# EAGLE design PCB (EAGLE 9.5.1)
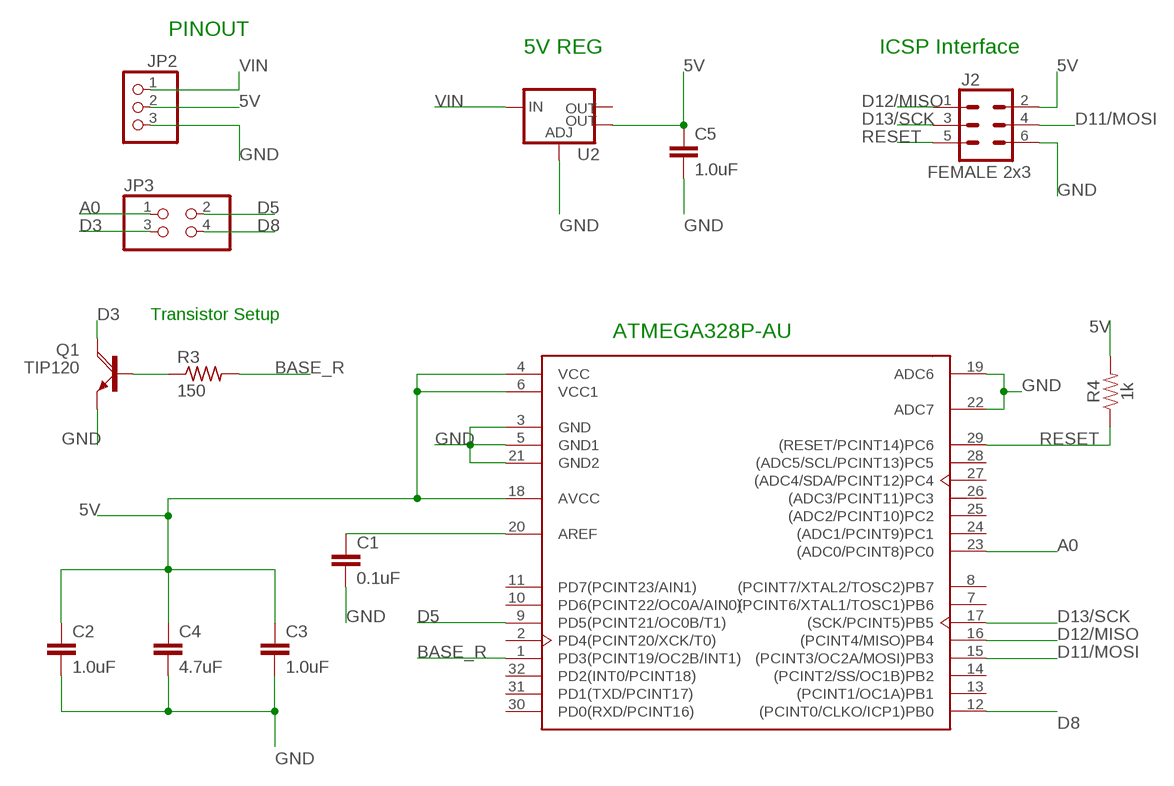
[diagram p0: schematic, sheet 1]

## Parts
C1  0.1uF  0.1UF-0603-25V-(+80/-20%)  [0603]
C2  1.0uF  1.0UF-0603-16V-10%  [0603]
C3  1.0uF  1.0UF-0603-16V-10%  [0603]
C4  4.7uF  4.7UF-1206-16V-(+80/-20%)  [1206]
C5  1.0uF  1.0UF-0603-16V-10%  [0603]
J2  FEMALE 2x3  CONN_03X2FEMALE  [2X3]
JP2  PINHEAD_PINHD-1X3  [PINHEAD_1X03]
JP3  PINHD-2X2  [2X02]
Q1  TIP120  [TO220AH]
R3  150  R-US_R0805  [R0805]
R4  1k  1KOHM-0603-1/10W-1%  [0603]
U1  ATMEGA328P-AU  [TQFP-32]
U2  V_REG_LM1117SOT223  [SOT223]

## Nets
5V: C2.1 C3.1 C4.1 C5.1 J2.2 JP2.2 R4.2 U1.4(VCC) U1.6(VCC1) U1.18(AVCC) U2.4(OUT)
A0: JP3.1 U1.23((ADC0/PCINT8)PC0)
BASE_R: R3.2 U1.1(PD3(PCINT19/OC2B/INT1))
D3: JP3.3 Q1.C
D5: JP3.2 U1.9(PD5(PCINT21/OC0B/T1))
D8: JP3.4 U1.12((PCINT0/CLKO/ICP1)PB0)
D11/MOSI: J2.4 U1.15((PCINT3/OC2A/MOSI)PB3)
D12/MISO: J2.1 U1.16((PCINT4/MISO)PB4)
D13/SCK: J2.3 U1.17((SCK/PCINT5)PB5)
GND: C1.2 C2.2 C3.2 C4.2 C5.2 J2.6 JP2.3 Q1.E U1.3(GND) U1.5(GND1) U1.19(ADC6) U1.21(GND2) U1.22(ADC7) U2.1(ADJ)
N$2: Q1.B R3.1
N$4: C1.1 U1.20(AREF)
RESET: J2.5 R4.1 U1.29((RESET/PCINT14)PC6)
VIN: JP2.1 U2.3(IN)
Unconnected: U1.2(PD4(PCINT20/XCK/T0)) U1.7((PCINT6/XTAL1/TOSC1)PB6) U1.8((PCINT7/XTAL2/TOSC2)PB7) U1.10(PD6(PCINT22/OC0A/AIN0)) U1.11(PD7(PCINT23/AIN1)) U1.13((PCINT1/OC1A)PB1) U1.14((PCINT2/SS/OC1B)PB2) U1.24((ADC1/PCINT9)PC1) U1.25((ADC2/PCINT10)PC2) U1.26((ADC3/PCINT11)PC3) U1.27((ADC4/SDA/PCINT12)PC4) U1.28((ADC5/SCL/PCINT13)PC5) U1.30(PD0(RXD/PCINT16)) U1.31(PD1(TXD/PCINT17)) U1.32(PD2(INT0/PCINT18)) U2.2(OUT)

## Notes on the sheet
- PINOUT
- 5V REG | ICSP Interface
- Transistor Setup
- ATMEGA328P-AU

## Library data of the parts
C1 = SparkFun-Capacitors:0.1UF: 0.1µF ceramic capacitors A capacitor is a passive two-terminal electrical component used to store electrical energy temporarily in an electric field.; PROD_ID: CAP-00810
C2 C3 C5 = SparkFun-Capacitors:1.0UF: 1µF ceramic capacitors A capacitor is a passive two-terminal electrical component used to store electrical energy temporarily in an electric field.; PROD_ID: CAP-00868
C4 = SparkFun-Capacitors:4.7UF: 4.7µF ceramic capacitors A capacitor is a passive two-terminal electrical component used to store electrical energy temporarily in an electric field.; PROD_ID: CAP-10300
J2 = SparkFun-Connectors:CONN_03X2: Multi connection point. Often used as Generic Header-pin footprint for 0.1 inch spaced/style header connections You can populate with any combo of single row headers, but if you'd like an exact match, check these: Header - 2x3 (Male, 0.1") <https://www.sparkfun.com/products/12807> (PRT-12807) Header - 2x3 (Female, 0.1") <https://www.sparkfun.com/products/13010> (PRT-13010) 2x3 Pin Shrouded Header <https://www.sparkfun.com/products/10877> (PRT-10877) On any of the 0.1 inch spaced packages, you can populate with these: Break Away Headers - Straight <https://www.sparkfun.com/products/116> (PRT-00116) Break Away Male Headers - Right Angle <https://www.sparkfun.com/products/553> (PRT-00553) Female Headers <https://www.sparkfun.com/products/115> (PRT-00115) Break Away Headers - Machine Pin <https://www.sparkfun.com/products/117> (PRT-00117) Break Away Female Headers - Swiss Machine Pin <https://www.sparkfun.com/products/743> (PRT-00743) Special note: the shrouded connector mates well with our 3x2 ribbon cables: Ribbon Crimp Connector - 6-pin (2x3, Female) <https://www.sparkfun.com/products/10651> (PRT-10651) Ribbon Cable - 6 wire (15ft) <https://www.sparkfun.com/products/10646> (PRT-10646); PROD_ID: CONN-11566
JP2 = IR_Sensor:PINHEAD_PINHD-1X3: PIN HEADER
JP3 = pinhead:PINHD-2X2: PIN HEADER
Q1 = transistor-power:TIP120: NPN DARLINGTON TRANSISTOR
R3 = rcl:R-US_: RESISTOR, American symbol; SPICEPREFIX: R
R4 = SparkFun-Resistors:1KOHM: 1kΩ resistor A resistor is a passive two-terminal electrical component that implements electrical resistance as a circuit element. Resistors act to reduce current flow, and, at the same time, act to lower voltage levels within circuits. - Wikipedia; PROD_ID: RES-07856
U1 = Microcontroller:ATMEGA328P-AU: IC MCU 8BIT 32KB FLASH 32TQFP Manufacturer's datasheet <http://ww1.microchip.com/downloads/en/DeviceDoc/ATmega48A-PA-88A-PA-168A-PA-328-P-DS-DS40002061A.pdf>; CREATED_BY: PCBLayout.com; DIGIKEY_PART_NUMBER: ATMEGA328P-AU-ND; MANUFACTURER: Microchip Technology; MPN: ATMEGA328P-AU; PACKAGE: TQFP-32
U2 = SparkFun-IC-Power:V_REG_LM1117: Voltage Regulator LM1117 Standard adjustable voltage regulator but in SMD form. Spark Fun Electronics SKU : COM-00595; PROD_ID: VREG-08170

## Board
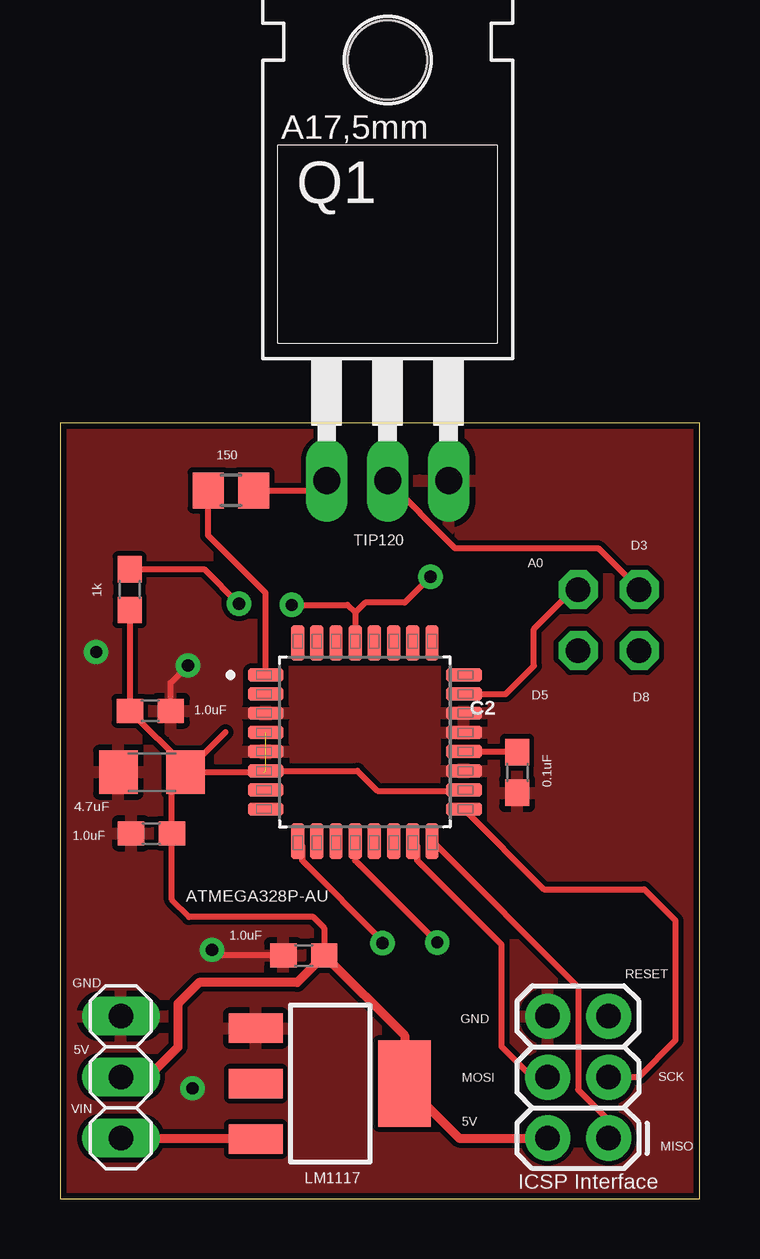
[diagram p1: board, top side]
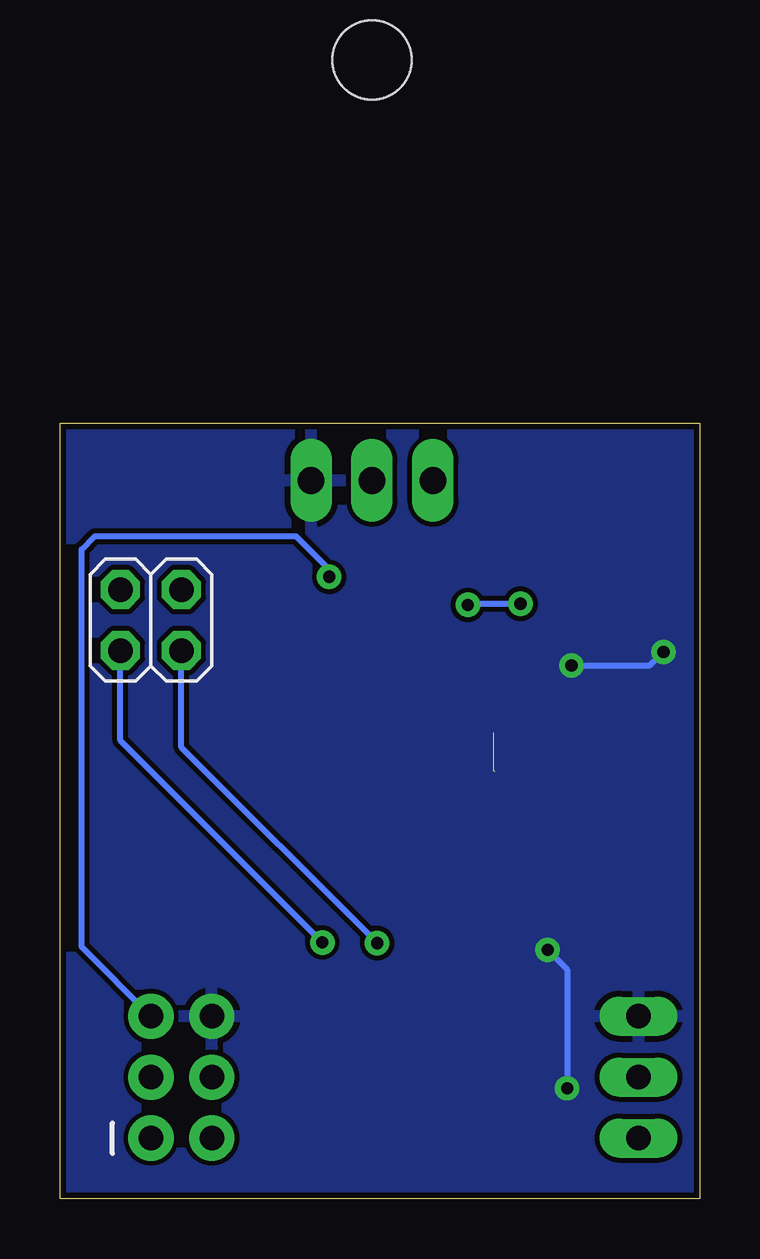
[diagram p2: board, bottom side, seen from below]

Size 26.65 x 32.35 mm. Coordinates in mm from the lower left corner, seen from the top.
Outline: 0,0 26.65,0 26.65,32.35 0,32.35 0,0
Copper layers (1*16): Top 0.035mm / dielectric 1.5mm / Bottom 0.035mm
Design rules "SparkFunDRC": minimum track width 8mil, minimum drill 20mil, track to track 8mil, track to pad 8mil, pad to pad 8mil, via to via 8mil, smd to smd 8mil, copper to edge 10mil, drill to drill 8mil, minimum pad ring 12mil, minimum via ring 10mil, stop-mask expansion 4mil, vias tented up to drill 25mil, thermal gap 10mil

### Footprints (pad centres in the part's own frame; a part is rotated, then mirrored left to right if it is on the bottom)
0603 = smd 1.1 x 1: 1 -0.85,0; 2 0.85,0
1206 = smd 1.6 x 1.8: 1 -1.4,0; 2 1.4,0
2X3 = drill 1.016 pad 1.88: 1 0,0; 2 0,2.54; 3 2.54,0; 4 2.54,2.54; 5 5.08,0; 6 5.08,2.54
PINHEAD_1X03 = drill 1.016 long: 1 -2.54,0; 2 0,0; 3 2.54,0
2X02 = drill 1.016 octagon: 1 -1.27,-1.27; 2 -1.27,1.27; 3 1.27,-1.27; 4 1.27,1.27
TO220AH = drill 1.118 long: B -2.54,-6.35; C 0,-6.35; E 2.54,-6.35 | hole 3.302: 0,11.176
R0805 = smd 1.3 x 1.5: 1 -0.95,0; 2 0.95,0
TQFP-32 = smd 1.5 x 0.57: 1 -4.13,2.8; 2 -4.13,2; 3 -4.13,1.2; 4 -4.13,0.4; 5 -4.13,-0.4; 6 -4.13,-1.2; 7 -4.13,-2; 8 -4.13,-2.8; 17 4.13,-2.8; 18 4.13,-2; 19 4.13,-1.2; 20 4.13,-0.4; 21 4.13,0.4; 22 4.13,1.2; 23 4.13,2; 24 4.13,2.8 | smd 0.57 x 1.5: 9 -2.8,-4.13; 10 -2,-4.13; 11 -1.2,-4.13; 12 -0.4,-4.13; 13 0.4,-4.13; 14 1.2,-4.13; 15 2,-4.13; 16 2.8,-4.13; 25 2.8,4.13; 26 2,4.13; 27 1.2,4.13; 28 0.4,4.13; 29 -0.4,4.13; 30 -1.2,4.13; 31 -2,4.13; 32 -2.8,4.13
SOT223 = smd 1.219 x 2.235: 1 -2.311,-3.099; 2 0,-3.099; 3 2.311,-3.099 | smd 3.6 x 2.2: 4 0,3.099

### Placement (x,y rotation side)
C1  19.05,17.78 270 top
C2  3.76,20.35 0 top
C3  3.81,15.24 180 top
C4  3.83,17.79 180 top
C5  10.16,10.16 180 top
J2  22.86,2.54 90 top
JP2  2.54,5.08 90 top
JP3  22.86,24.13 180 bottom
Q1  13.65,36.3 0 top
R3  7.12,29.54 180 top
R4  2.9,25.4 270 top
U1  12.7,19.05 0 top
U2  11.26,4.81 270 top

### Tracks (layer width: path | path; a pad name or v marks a point on that pad's centre or on a via)
5V  (2 unrouted)
  Top 0.254: R4.2 2.9,20.36 C2.1 5.23,18.03 C4.1 | C5.1 11.01,11.3 10.55,11.76 5.38,11.76 4.66,12.47 C3.1 4.66,17.22 C4.1 | 6.89,19.45 C4.1 | C4.1 8.51,17.79 | U1.6 12.39,17.85 13.23,17.02 16.8,17.02 U1.18
  Top 0.381: JP2.2 3.66,5.08 4.92,6.33 4.92,8.14 5.8,9.03 9.88,9.03 C5.1 14.36,6.81 U2.4 16.63,2.54 J2.2
A0
  Top 0.254: U1.23 18.57,21.05 19.75,22.23 19.75,23.75 21.39,25.4 JP3.1
BASE_R
  Top 0.254: U1.1 8.57,25.26 6.17,27.66 R3.2
D3
  Top 0.254: Q1.C 15,28.61 15,28.59 16.46,27.14 22.42,27.14 24.13,25.42 JP3.3
D5  (via drill 0.51)
  Top 0.254: U1.9 10.09,14.73 10.09,14.12 13.43,10.77 v13.43,10.67
  Bottom 0.254: v13.43,10.67 21.59,18.82 JP3.2
D8  (via drill 0.51)
  Top 0.254: U1.12 12.3,14.11 v15.72,10.69
  Bottom 0.254: v15.72,10.69 24.13,19.11 JP3.4
D11/MOSI
  Top 0.254: U1.15 14.88,14.73 14.88,14.12 18.39,10.61 18.39,6.36 19.67,5.08 J2.4
D12/MISO
  Top 0.254: U1.16 21.59,8.83 21.59,4.55 22.86,3.28 J2.1
D13/SCK
  Top 0.254: U1.17 20.16,12.92 24.34,12.92 25.64,11.61 25.64,6.62 24.11,5.08 J2.3
GND  (via drill 0.51)
  Top 0.254: C5.2 6.56,10.16 v6.33,10.38 | C2.2 4.61,21.52 v5.33,22.24
  Bottom 0.254: v5.33,22.24 2.07,22.24 v1.51,22.8 | v6.33,10.38 5.52,9.57 v5.52,4.62
  pour Bottom (isolate 0): -0.03,32.39 -0.03,0 26.67,0 26.67,32.39
  pour Top (isolate 0): 0,32.39 0,0 26.67,0 26.67,32.39
N$2
  Top 0.254: R3.1 10.69,29.54 Q1.B
N$4
  Top 0.254: U1.20 19.03,18.65 C1.1
RESET  (via drill 0.51)
  Top 0.254: R4.1 6,26.25 v7.45,24.8 v7.46,24.81 | v9.66,24.77 11.98,24.77 12.3,24.44 | 12.3,24.44 U1.29 | v15.44,25.93 14.36,24.86 12.72,24.86 12.3,24.44
  Bottom 0.254: v7.46,24.81 9.63,24.81 v9.66,24.77 | J2.5 25.75,10.51 25.75,27.08 25.2,27.63 16.82,27.63 15.44,26.25 v15.44,25.93
VIN
  Top 0.381: JP2.1 8.12,2.54 U2.3

### Text on the board
tPlace: TIP120 | D3 | A0 | D5 | D8 | ATMEGA328P-AU | GND | RESET | GND | 5V | MOSI | SCK | VIN | 5V | MISO | LM1117 | ICSP Interface